# Altium schematic sheet 05 SERVO_FAN.SchDoc
size A
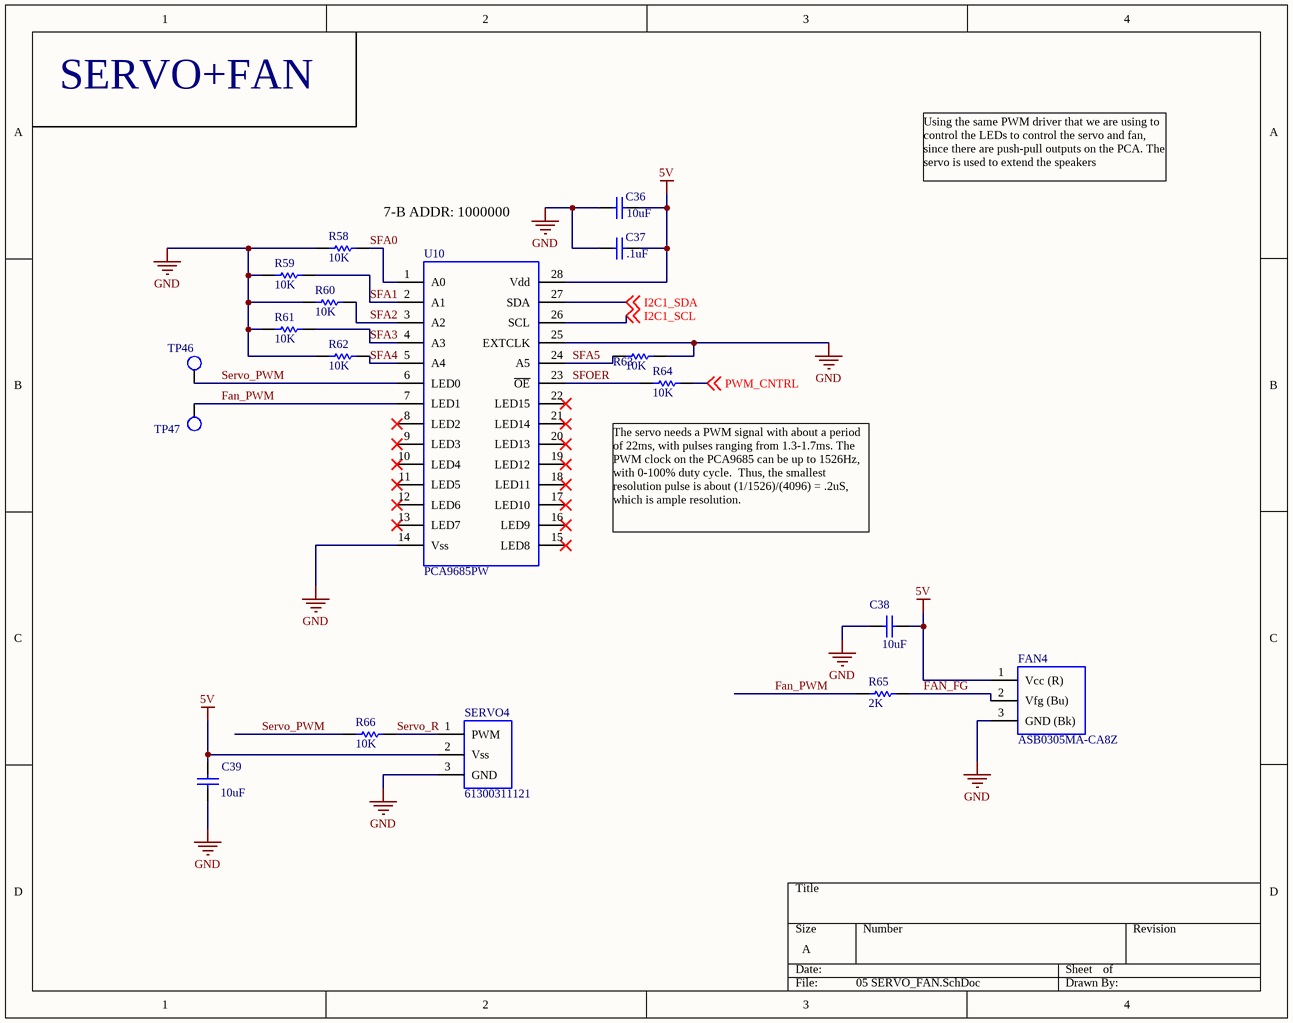
[diagram p0: 05 SERVO_FAN.SchDoc]

## Parts
C36  value 10uF  [CAPC2012X135N]  (hidden comment: CAP_0805_10u_16V)
C37  value .1uF  [CAPC2012X135N]  (hidden comment: CAP_0805_.1u_250V)
C38  value 10uF  [CAPC2012X135N]  (hidden comment: CAP_0805_10u_16V)
C39  value 10uF  [CAPC2012X135N]  (hidden comment: CAP_0805_10u_16V)
FAN4  ASB0305MA-CA8Z  [FAN_HEADER]
R58  Resistance: 10K  [RES0805]  (hidden comment: RES_0805_10K)
R59  Resistance: 10K  [RES0805]  (hidden comment: RES_0805_10K)
R60  Resistance: 10K  [RES0805]  (hidden comment: RES_0805_10K)
R61  Resistance: 10K  [RES0805]  (hidden comment: RES_0805_10K)
R62  Resistance: 10K  [RES0805]  (hidden comment: RES_0805_10K)
R63  Resistance: 10K  [RES0805]  (hidden comment: RES_0805_10K)
R64  Resistance: 10K  [RES0805]  (hidden comment: RES_0805_10K)
R65  RES_0805_2K  [RES0805]  (value not drawn)
R66  Resistance: 10K  [RES0805]  (hidden comment: RES_0805_10K)
SERVO4  61300311121  [SERVO_HEADER]
TP46  TP  [TestPoint_0805]  (value not drawn)
TP47  TP  [TestPoint_0805]  (value not drawn)
U10  PCA9685PW  [TSSOP28]

## Nets
5V: C36.2 C37.2 C38.1 C39.2 FAN4.1(Vcc_(R)) SERVO4.2(Vss) U10.28(Vdd)
GND: C36.1 C37.1 C38.2 C39.1 FAN4.3(GND_(Bk)) R58.1 R59.1 R60.1 R61.1 R62.1 R63.2 SERVO4.3(GND) U10.14(Vss) U10.25(EXTCLK)
FAN_FG: FAN4.2(Vfg_(Bu)) R65.2
Fan_PWM: R65.1 TP47.1 U10.7(LED1)
I2C1_SCL: U10.26(SCL) ; off-sheet I2C1_SCL
I2C1_SDA: U10.27(SDA) ; off-sheet I2C1_SDA
PWM_CNTRL: R64.2 ; off-sheet PWM_CNTRL
Servo_PWM: R66.1 TP46.1 U10.6(LED0)
Servo_R: R66.2 SERVO4.1(PWM)
SFA0: R58.2 U10.1(A0)
SFA1: R59.2 U10.2(A1)
SFA2: R60.2 U10.3(A2)
SFA3: R61.2 U10.4(A3)
SFA4: R62.2 U10.5(A4)
SFA5: R63.1 U10.24(A5)
SFOER: R64.1 U10.23(~{OE})

Not connected (* = marked no-connect by the designer): U10 8(LED2)* 9(LED3)* 10(LED4)* 11(LED5)* 12(LED6)* 13(LED7)* 15(LED8)* 16(LED9)* 17(LED10)* 18(LED11)* 19(LED12)* 20(LED13)* 21(LED14)* 22(LED15)*

## Notes on the sheet
- SERVO+FAN
- 7-B ADDR: 1000000
- Using the same PWM driver that we are using to control the LEDs to control the servo and fan, since there are push-pull outputs on the PCA. The servo is used to extend the speakers
- (near R64) The servo needs a PWM signal with about a period of 22ms, with pulses ranging from 1.3-1.7ms. The PWM clock on the PCA9685 can be up to 1526Hz, with 0-100% duty cycle.  Thus, the smallest resolution pulse is about (1/1526)/(4096) = .2uS, which is ample resolution.
- (in symbol RES_0805_2K) 2K

## Library data of the parts
C36 C38 C39 = CAP_0805_10u_16V: Cap Ceramic 10uF 16V X5R 10% SMD 0805 85C T/R; Manufacturer: Johanson Dielectrics; Manufacturer Part Number: 160R15X106KV4E; Supplier 1: Digi-Key; Supplier Part Number 1: 709-1229-1-ND; Stock 1: 36636; Pricing 1: 1=0.55, 10=0.387, 100=0.2552, 500=0.189, 1000=0.1607 (USD); Mount: Surface Mount; Case/Package: 0805; Number of Pins: 2; Weight: 0.000194oz; Case Code (Imperial): 0805; Case Code (Metric): 2012; Min Operating Temperature: -55°C; Max Operating Temperature: 85°C; Voltage Rating: 16V; Capacitance: 10uF; Voltage Rating (DC): 16V; Tolerance: 10%; Packaging: Tape and Reel; Package Quantity: 2000; Dielectric: X5R; Termination: SMD/SMT; Length: 2.03mm; Height: 1.27mm; Width: 1.27mm; Thickness: 0.06inch; Depth: 1.27mm; Radiation Hardening: No; REACH SVHC: No SVHC; ComponentLink1URL: https://datasheet.ciiva.com/26948/getdatasheetpartid-132904-26948555.pdf; ComponentLink1Description: https://datasheet.ciiva.com/26948/getdatasheetpartid-132904-26948555.pdf
C37 = CAP_0805_.1u_250V: Cap Ceramic 0.1uF 250V X7T 10% SMD 0805 125C Plastic T/R; Manufacturer: TDK; Manufacturer Part Number: C2012X7T2E104K125AE; Capacitance: 100nF; Supplier 1: Digi-Key; Supplier Part Number 1: 445-8883-1-ND; Stock 1: 30376; Pricing 1: 1=0.37, 10=0.25, 100=0.1419, 500=0.1002, 1000=0.0877 (USD); Case/Package: 0805; Weight: 0.000194oz; Case Code (Metric): 2012; Case Code (Imperial): 0805; Min Operating Temperature: -55°C; Max Operating Temperature: 125°C; Package Quantity: 1; Voltage Rating: 250V; Tolerance: 10%; Packaging: Tape and Reel; Voltage Rating (DC): 250V; Dielectric: X7T; Termination: SMD/SMT; Composition: Ceramic; Length: 2mm; Height: 1.25mm; Width: 0.05inch; Thickness: 0.049inch; Depth: 1.25mm; REACH SVHC: No SVHC; ComponentLink1URL: https://datasheet.ciiva.com/24219/c2012x7t2e104k125ae-265154-24219519.pdf; ComponentLink1Description: https://datasheet.ciiva.com/24219/c2012x7t2e104k125ae-265154-24219519.pdf
FAN4 = ASB0305MA-CA8Z: FAN AXIAL 30X10MM 5VDC WIRE; Manufacturer: Delta Design; Airflow: 3.4CFM; Noise: 23dBA; Current Rating: 110mA; Max Power Dissipation: 550mW; RPM: 9000RPM; Bearing Type: Sleeve; Supplier 1: Digi-Key; Supplier Part Number 1: 603-1847-ND; Manufacturer Part Number: ASB0305MA-CA8Z; Stock 1: 98; Pricing 1: 1=6.96, 10=6.38, 50=5.365 (USD); Weight: 0.015lb; Min Operating Temperature: 14°C; Max Operating Temperature: 158°C; Package Quantity: 720; Termination: 3 Wire Leads; Width: 10mm; ComponentLink1URL: //media.digikey.com/pdf/Data%20Sheets/Delta%20PDFs/ASB0305MA-CA8Z_Spec.pdf; ComponentLink1Description: //media.digikey.com/pdf/Data%20Sheets/Delta%20PDFs/ASB0305MA-CA8Z_Spec.pdf
R58-R64 R66 = RES_0805_10K: RES, THICK FILM, 10K, 5%, 0.125W, 0805; Manufacturer: Yageo; Manufacturer Part Number: RC0805JR-0710KL; Power Rating: 125mW; Voltage Rating: 150V; Temperature Coefficient: 100ppm/°C; Supplier 1: Digi-Key; Stock 1: 1285290; Pricing 1: 1=0.1, 10=0.019, 100=0.0076, 1000=0.0034, 2500=0.003 (USD); Case/Package: 0805; Case Code (Imperial): 0805; Case Code (Metric): 2012; Contact Plating: Tin,Matte; Min Operating Temperature: -55°C; Max Operating Temperature: 155°C; Tolerance: 5%; Packaging: Tape and Reel; Termination: SMD/SMT; Composition: Thick Film; Military Standard: Not; Length: 2mm; Height: 0.5mm; Depth: 1.25mm; Width: 1.25mm; Radiation Hardening: No; REACH SVHC: Unknown; Lead Free: Lead Free; ComponentLink1URL: https://datasheet.ciiva.com/7983/444164-7983765.pdf; ComponentLink1Description: https://datasheet.ciiva.com/7983/444164-7983765.pdf; ComponentLink2URL: https://datasheet.ciiva.com/7941/444164-7941870.pdf; ComponentLink2Description: https://datasheet.ciiva.com/7941/444164-7941870.pdf; ComponentLink3URL: https://datasheet.ciiva.com/7941/444164-7941871.pdf; ComponentLink3Description: https://datasheet.ciiva.com/7941/444164-7941871.pdf; Supplier Part Number 1: 311-10KARCT-ND
R65 = RES_0805_2K: RES SMD 2K OHM 5% 1/8W 0805; Manufacturer: Yageo; Manufacturer Part Number: RC0805JR-072KL; Resistance: 2KR; Power Rating: 125mW; Voltage Rating: 150V; Temperature Coefficient: 100ppm/°C; Supplier 1: Digi-Key; Supplier Part Number 1: 311-2.0KARCT-ND; Stock 1: 297667; Pricing 1: 1=0.1, 10=0.016, 25=0.0116, 50=0.009, 100=0.0066, 250=0.005, 500=0.004, 1000=0.003 (USD); Case/Package: 0805; Number of Pins: 2; Case Code (Metric): 2012; Case Code (Imperial): 0805; Contact Plating: Tin,Lead,Matte; Min Operating Temperature: -55°C; Max Operating Temperature: 155°C; Tolerance: 5%; Packaging: Tape and Reel; Package Quantity: 1; Composition: Thick Film; Number of Terminations: 2; Termination: SMD/SMT; Military Standard: Not; Max Power Dissipation: 125mW; Voltage Rating (DC): 150V; Length: 2mm; Height: 0.024inch; Width: 0.049inch; Depth: 1.25mm; Radiation Hardening: No; REACH SVHC: No SVHC; Lead Free: Lead Free; ComponentLink1URL: https://datasheet.ciiva.com/46395/444164-46395141.pdf; ComponentLink1Description: https://datasheet.ciiva.com/46395/444164-46395141.pdf; ComponentLink2URL: https://datasheet.ciiva.com/2456/pyu-r-int-thick-7-2456104.pdf; ComponentLink2Description: https://datasheet.ciiva.com/2456/pyu-r-int-thick-7-2456104.pdf; ComponentLink3URL: https://datasheet.ciiva.com/2456/pyu-r-int-thick-7-2456105.pdf; ComponentLink3Description: https://datasheet.ciiva.com/2456/pyu-r-int-thick-7-2456105.pdf; ComponentLink4URL: https://datasheet.ciiva.com/2456/pyu-r-int-thick-7-2456106.pdf; ComponentLink4Description: https://datasheet.ciiva.com/2456/pyu-r-int-thick-7-2456106.pdf; ComponentLink5URL: https://datasheet.ciiva.com/12666/rc0805-12666941.pdf; ComponentLink5Description: https://datasheet.ciiva.com/12666/rc0805-12666941.pdf
SERVO4 = Servo_Header: Board-To-Board Connector, Vertical, WR-PHD Series, Through Hole, Header, 3 Contacts, 2.54 mm; Manufacturer: Wurth Electronics; Number of Positions: 3; Gender: Male; Connector Type: Male Pin; Pitch: 0.1inch; Supplier 1: Digi-Key; Supplier 2: Digi-Key; Supplier Part Number 1: 900-00008-ND; Supplier Part Number 2: 732-5316-ND; Manufacturer Part Number: 61300311121; Stock 2: 24543; Pricing 2: 1=0.13, 10=0.106, 25=0.088, 50=0.074, 100=0.067, 1000=0.061 (USD); Mount: Through Hole; Case/Package: 100; Contact Plating: Gold; Contact Material: Copper; Colour: Black; Number of Rows: 1; Packaging: Bulk; Termination: Solder; Number of Contacts: 3; Contact Mating Length: 0.236inch; REACH SVHC: Unknown; Lead Free: Lead Free; ComponentLink1URL: http://www.farnell.com/cad/1737268.pdf; ComponentLink1Description: http://www.farnell.com/cad/1737268.pdf
TP46 TP47 = TP: Testpoint_0805; Manufacturer: TE Connectivity; Manufacturer Part Number: 1625854-2; Resistance: 0mR; Supplier 1: Digi-Key; Stock 1: 27299; Pricing 1: 1=0.21, 10=0.2, 25=0.1708, 50=0.1496, 100=0.1389, 250=0.1229, 500=0.1175, 1000=0.0962 (USD); Case/Package: 0805; Colour: Natural; Min Operating Temperature: -55°C; Max Operating Temperature: 125°C; Packaging: Tape and Reel; Package Quantity: 2000; Military Standard: Not; Length: 2mm; Depth: 1.2mm; Radiation Hardening: No; Lead Free: Lead Free; ComponentLink1URL: https://datasheet.ciiva.com/6439/eng-ds-1773266-a-6439169.pdf; ComponentLink1Description: https://datasheet.ciiva.com/6439/eng-ds-1773266-a-6439169.pdf; ComponentLink2URL: https://datasheet.ciiva.com/30238/1773266-a-30238966.pdf; ComponentLink2Description: https://datasheet.ciiva.com/30238/1773266-a-30238966.pdf; ComponentLink3URL: https://datasheet.ciiva.com/8914/eng-ds-1773266-a-8914649.pdf; ComponentLink3Description: https://datasheet.ciiva.com/8914/eng-ds-1773266-a-8914649.pdf; Supplier Part Number 1: A106144CT-ND; Mount: Surface Mount
U10 = PCA9685PW: IC LED DRIVER RGBA 28-TSSOP; Manufacturer: NXP Semiconductors; Manufacturer Part Number: PCA9685PW,118; Number of Outputs: 16; Frequency: 1MHz; Max Supply Voltage: 5.5V; Min Supply Voltage: 2.3V; Nominal Supply Current: 10A; Output Current per Channel: 25mA; High Level Output Current: 10mA; Low Level Output Current: 400A; Power Dissipation: 400W; Supplier 1: Digi-Key; Stock 1: 2599; Pricing 1: 1=2.31, 10=2.074, 100=1.6674, 500=1.3699, 1000=1.1351 (USD); Mount: Surface Mount; Case/Package: TSSOP; Number of Pins: 28; Min Operating Temperature: -40°C; Max Operating Temperature: 85°C; Packaging: Tape and Reel; Package Quantity: 2500; Output Voltage: 5.5V; Radiation Hardening: No; Lead Free: Lead Free; ComponentLink1URL: https://datasheet.ciiva.com/1947/pca9685-1947062.pdf; ComponentLink1Description: https://datasheet.ciiva.com/1947/pca9685-1947062.pdf; ComponentLink2URL: https://datasheet.ciiva.com/15134/getdatasheetpartid-103066-15134201.pdf; ComponentLink2Description: https://datasheet.ciiva.com/15134/getdatasheetpartid-103066-15134201.pdf; ComponentLink3URL: https://datasheet.ciiva.com/8125/pca9685-8125357.pdf; ComponentLink3Description: https://datasheet.ciiva.com/8125/pca9685-8125357.pdf; Supplier Part Number 1: 568-11925-1-ND